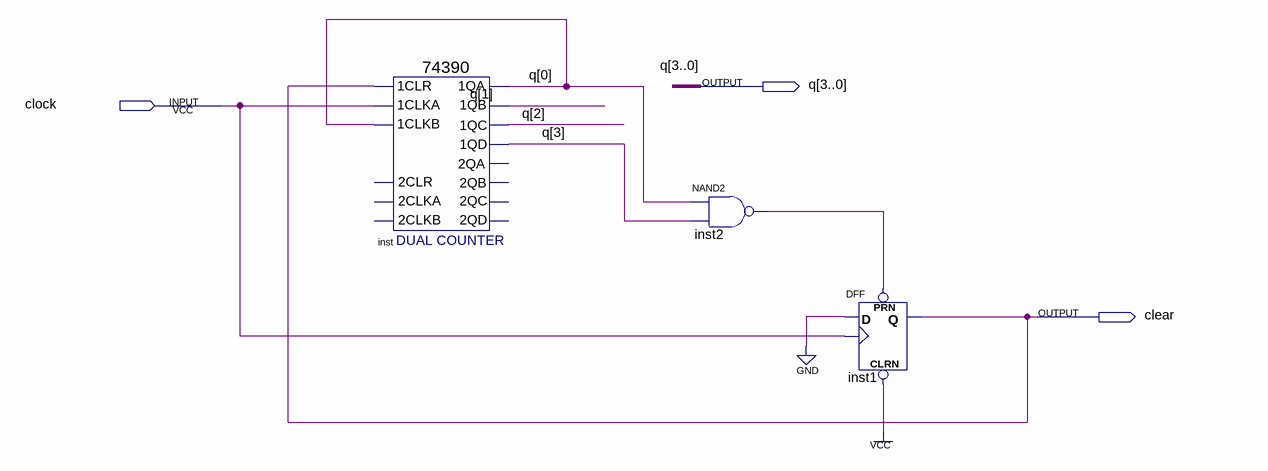
[diagram p0: schematic sheet]
// Quartus schematic cnt10.bdf as structural Verilog: 3 symbols, 3 pins
module cnt10 (
  input  clock,
  output [3:0] q,
  output clear
);

  wire inst2_out;

  \74390  inst (
    .\1CLR (clear), .\1CLKA (clock), .\1CLKB (q[0]), .\1QA (q[0]), .\1QB (q[1]), .\1QC (q[2]), .\1QD (q[3]));  // open: 2CLKA, 2CLR, 2CLKB, 2QA, 2QB, 2QC, 2QD
  nand inst2 (inst2_out, q[0], q[3]);
  DFF inst1 (.CLRN(1'b1), .CLK(clock), .D(1'b0), .PRN(inst2_out), .Q(clear));
endmodule
